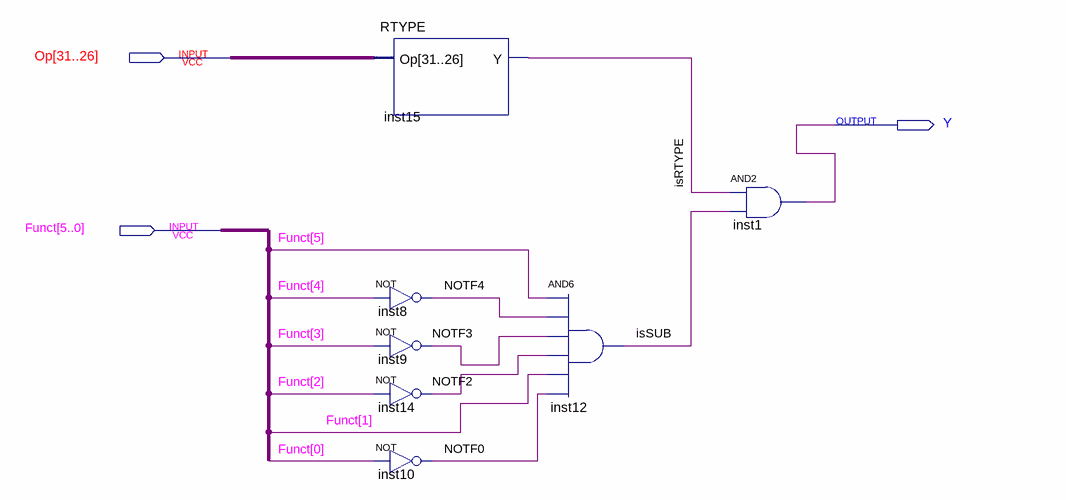
[diagram p0: schematic sheet]
// Quartus schematic SUB.bdf as structural Verilog: 7 symbols, 3 pins
module SUB (
  input  [31:26] Op,
  input  [5:0] Funct,
  output Y
);

  wire isRTYPE, isSUB, NOTF0, NOTF2, NOTF3, NOTF4;

  RTYPE inst15 (.Op(Op), .Y(isRTYPE));
  not inst8 (NOTF4, Funct[4]);
  not inst9 (NOTF3, Funct[3]);
  not inst14 (NOTF2, Funct[2]);
  not inst10 (NOTF0, Funct[0]);
  and inst12 (isSUB, Funct[5], NOTF4, NOTF3, NOTF2, Funct[1], NOTF0);
  and inst1 (Y, isRTYPE, isSUB);
endmodule
